# Altium schematic sheet CAN_SW.SchDoc
size A; SheetNumber: 6; SheetTotal: 6
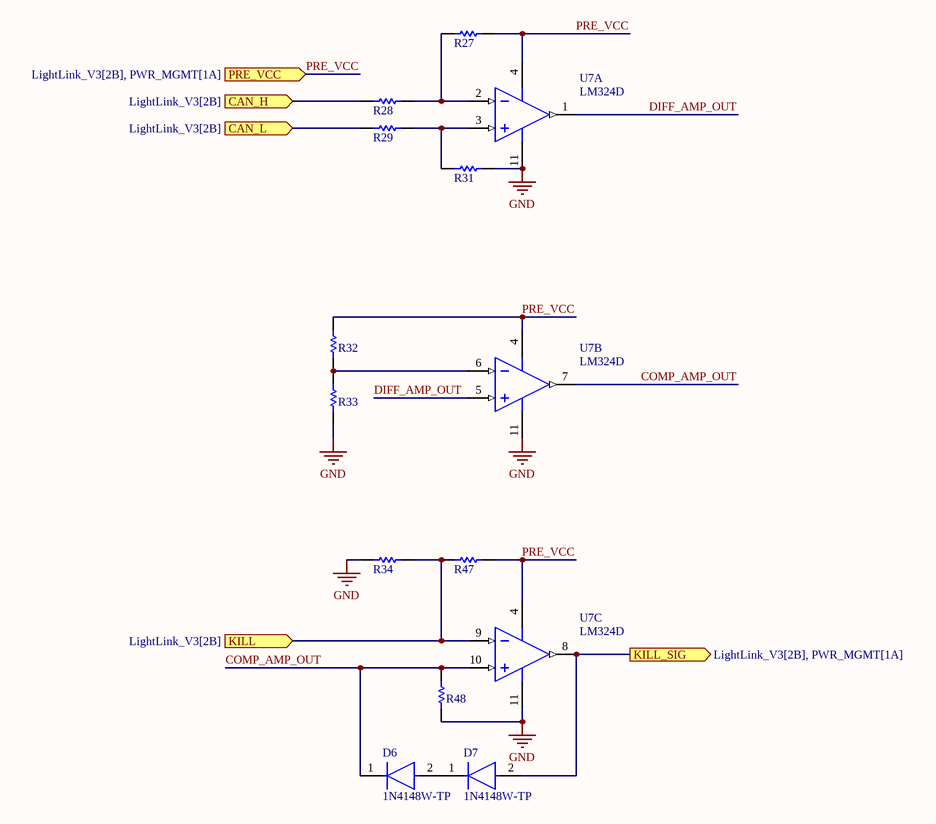
[diagram p0: CAN_SW.SchDoc]

## Parts
D6  1N4148W-TP  [FP-SOD-123-IPC_A]
D7  1N4148W-TP  [FP-SOD-123-IPC_A]
R27  ERJ3EKF1002V  [RESC1609X55X30LL15T15]  (value not drawn)
R28  ERJ3EKF1002V  [RESC1609X55X30LL15T15]  (value not drawn)
R29  ERJ3EKF1002V  [RESC1609X55X30LL15T15]  (value not drawn)
R31  ERJ3EKF1002V  [RESC1609X55X30LL15T15]  (value not drawn)
R32  ERJ3EKF1002V  [RESC1609X55X30LL15T15]  (value not drawn)
R33  ERJ-3EKF1001V  [RESC1608X55X30LL15T15]  (value not drawn)
R34  ERJ3EKF1002V  [RESC1609X55X30LL15T15]  (value not drawn)
R47  ERJ3EKF1002V  [RESC1609X55X30LL15T15]  (value not drawn)
R48  ERJ3EKF1002V  [RESC1609X55X30LL15T15]  (value not drawn)
U7  LM324D  [D0014A_L]  (parts A,B,C of 4)

## Ports
CAN_H (in, see LightLink_V3[2B]), CAN_L (in, see LightLink_V3[2B]), KILL (in, see LightLink_V3[2B]), KILL_SIG (out, see LightLink_V3[2B], PWR_MGMT[1A]), PRE_VCC (in, see LightLink_V3[2B], PWR_MGMT[1A])

## Nets
GND: R31.2 R33.1 R34.2 R48.1 U7.11(GND)
CAN_H: R28.1 ; port CAN_H
CAN_L: R29.1 ; port CAN_L
COMP_AMP_OUT: D6.1(C) R48.2 U7.7(2OUT) U7.10(3IN+)
DIFF_AMP_OUT: U7.1(1OUT) U7.5(2IN+)
KILL: R34.1 R47.2 U7.9(3IN-) ; port KILL
KILL_SIG: D7.2(A) U7.8(3OUT) ; port KILL_SIG
PRE_VCC: R27.2 R32.2 R47.1 U7.4(VCC) ; port PRE_VCC
NetD6_2: D6.2(A) D7.1(C)
NetR27_1: R27.1 R28.2 U7.2(1IN-)
NetR29_2: R29.2 R31.1 U7.3(1IN+)
NetR32_1: R32.1 R33.2 U7.6(2IN-)

## Library data of the parts
D6 D7 = CMP-2000-04993-2: DIODE GEN PURP 100V 150MA SOD123; Max Reverse Leakage Current: 5uA; Max Surge Current: 2A; Reverse Recovery Time: 4ns; Polarity: Standard; Capacitance: 4pF; Max Forward Surge Current (Ifsm): 1A; Element Configuration: Single; Power Dissipation: 400mW; Forward Voltage: 1V; Radiation Hardening: No; Lead Free: Lead Free; Max Reverse Voltage (DC): 100V; Current Rating: 150mA; Forward Current: 150mA; Packaging: Tape and Reel; Number of Pins: 2; Package Quantity: 3000; Max Operating Temperature: 150°C; Min Operating Temperature: -65°C; Average Rectified Current: 150mA; Recovery Time: 4ns; Output Current: 150mA; Peak Non-Repetitive Surge Current: 2A; Width: 1.8mm; Voltage Rating (DC): 100V; Height: 1.2mm; Max Repetitive Reverse Voltage (Vrrm): 100V; Mount: Surface Mount; Length: 2.85mm
R27-R29 R31 R32 R34 R47 R48 = CMP-1012-00623-3: Chip Resistor, 10 KOhm, +/- 1%, 0.1 W, -55 to 155 degC, 0603 (1608 Metric), RoHS, Tape and Reel; Manufacturer: Panasonic; Voltage Rating: 75V; Case\/Package: 0603; Power Rating: 100mW; Resistance: 10KOhm; Temperature Coefficient: 100ppm\/degreesC; Number of Pins: 2; Package Reference: 603; Depth: 0.8mm; Mount: SurfaceMount; Package Description: 2-Pin Surface Mount Device, Body 1.6 x 0.85 mm; Datasheet Version: 02/2017; Length: 1.6mm; Lead Free: LeadFree; Height: 0.45mm; Number of Terminations: 2; Max Power Dissipation: 100mW; Min Operating Temperature: -55degC; Datasheet URL: https://industrial.panasonic.com/cdbs/www-data/pdf/RDA0000/AOA0000C304.pdf; Termination: SMD/SMT; Case Code (Metric): 1608; Case Code (Imperial): 0603; Tolerance: 1%; Max Operating Temperature: 155degC; RoHSCompliant: true; Voltage Rating (DC): 75V; Radiation Hardening: No; Packaging: TapeandReel; Composition: ThickFilm; Mounting Technology: SurfaceMount; Manufacturer URL: http://www.panasonic.com/; Width: 0.031inch; REACH SVHC: NoSVHC; Contact Plating: Tin; Military Standard: Not; Package Quantity: 1
R33 = CMP-2000-00180-1: Manufacturer: Panasonic; Part Number: ERJ-3EKF1001V
U7 = CMP-2000-06547-1: Quadruple Operational Amplifier, 0.5 V/us, 1.2 MHz, 3 to 32 V, 0 to 70 degC, 14-Pin SOIC (D), Green (RoHS & no Sb/Br), Tube; Manufacturer: Texas Instruments; Unity Gain Bandwidth Product: 1.2MHz; Input Offset Voltage: 7mV; Dual Supply Voltage (Max): ±16V; Single Supply Voltage (Min): 3V; Single Supply Voltage (Max): 32V; Voltage Gain in dB: 100dB; Power Supply Requirement: Single/Dual; Input Bias Current: 250nA; Dual Supply Voltage (Min): ±1.5V; Single Supply Voltage (Typ): 5/9/12/15/18/24/28V; Dual Supply Voltage (Typ): ±3/±5/±9/±12/±15V; Number of  Elements: 4; Common Mode Rejection Ratio: 65dB; Datasheet Version: Rev. W, 03/2015; Technology: Bipolar; Shut Down Feature: No; Package Reference: D0014A; Type: GeneralPurposeAmplifier; Pin Count: 14; Package Type: SOIC; Rail/Rail I/O Type: No; Manufacturer URL: http://www.ti.com/; Package Description: 14-Pin Small Outline Integrated Circuit, Body 8.65 x 3.9 mm, Pitch 1.27 mm; Operating Temperature Classification: Commercial; Datasheet URL: http://www.ti.com/lit/ds/symlink/lm324.pdf; Slew Rate: 0.5V/us; Package URL: http://www.ti.com/lit/ml/mpds177g/mpds177g.pdf; Mounting: SurfaceMount; Packaging: Rail/Tube; Mounting Technology: SurfaceMount; Operating Temp Range: 0Cto70C